# Altium schematic sheet HAOYU-YX32B.SchDoc
size A
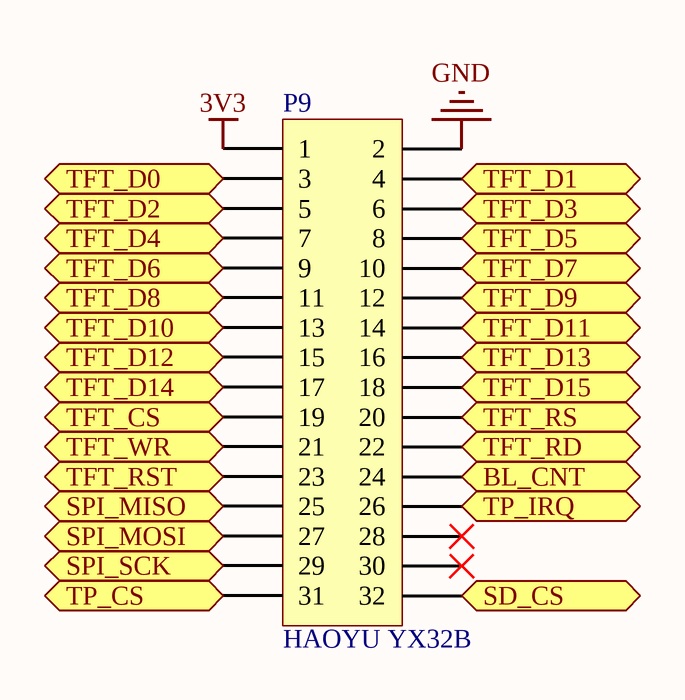
[diagram p0: HAOYU-YX32B.SchDoc]

## Parts
P9  HAOYU YX32B  [HDR2X16]

## Ports
BL_CNT, SD_CS, SPI_MISO, SPI_MOSI, SPI_SCK, TFT_CS, TFT_D0, TFT_D1, TFT_D2, TFT_D3, TFT_D4, TFT_D5, TFT_D6, TFT_D7, TFT_D8, TFT_D9, TFT_D10, TFT_D11, TFT_D12, TFT_D13, TFT_D14, TFT_D15, TFT_RD, TFT_RS, TFT_RST, TFT_WR, TP_CS, TP_IRQ

## Nets
3V3: P9.1
GND: P9.2
BL_CNT: P9.24 ; port BL_CNT
SD_CS: P9.32 ; port SD_CS
SPI_MISO: P9.25 ; port SPI_MISO
SPI_MOSI: P9.27 ; port SPI_MOSI
SPI_SCK: P9.29 ; port SPI_SCK
TFT_CS: P9.19 ; port TFT_CS
TFT_D0: P9.3 ; port TFT_D0
TFT_D1: P9.4 ; port TFT_D1
TFT_D2: P9.5 ; port TFT_D2
TFT_D3: P9.6 ; port TFT_D3
TFT_D4: P9.7 ; port TFT_D4
TFT_D5: P9.8 ; port TFT_D5
TFT_D6: P9.9 ; port TFT_D6
TFT_D7: P9.10 ; port TFT_D7
TFT_D8: P9.11 ; port TFT_D8
TFT_D9: P9.12 ; port TFT_D9
TFT_D10: P9.13 ; port TFT_D10
TFT_D11: P9.14 ; port TFT_D11
TFT_D12: P9.15 ; port TFT_D12
TFT_D13: P9.16 ; port TFT_D13
TFT_D14: P9.17 ; port TFT_D14
TFT_D15: P9.18 ; port TFT_D15
TFT_RD: P9.22 ; port TFT_RD
TFT_RS: P9.20 ; port TFT_RS
TFT_RST: P9.23 ; port TFT_RST
TFT_WR: P9.21 ; port TFT_WR
TP_CS: P9.31 ; port TP_CS
TP_IRQ: P9.26 ; port TP_IRQ

Not connected (* = marked no-connect by the designer): P9 28* 30*

## Library data of the parts
P9 = Header 16X2: Header, 16-Pin, Dual row; Supplier 1: Digi-Key; Supplier Part Number 1: S7119-ND